# EAGLE design sentinel psionic driver (EAGLE 7.6.0)
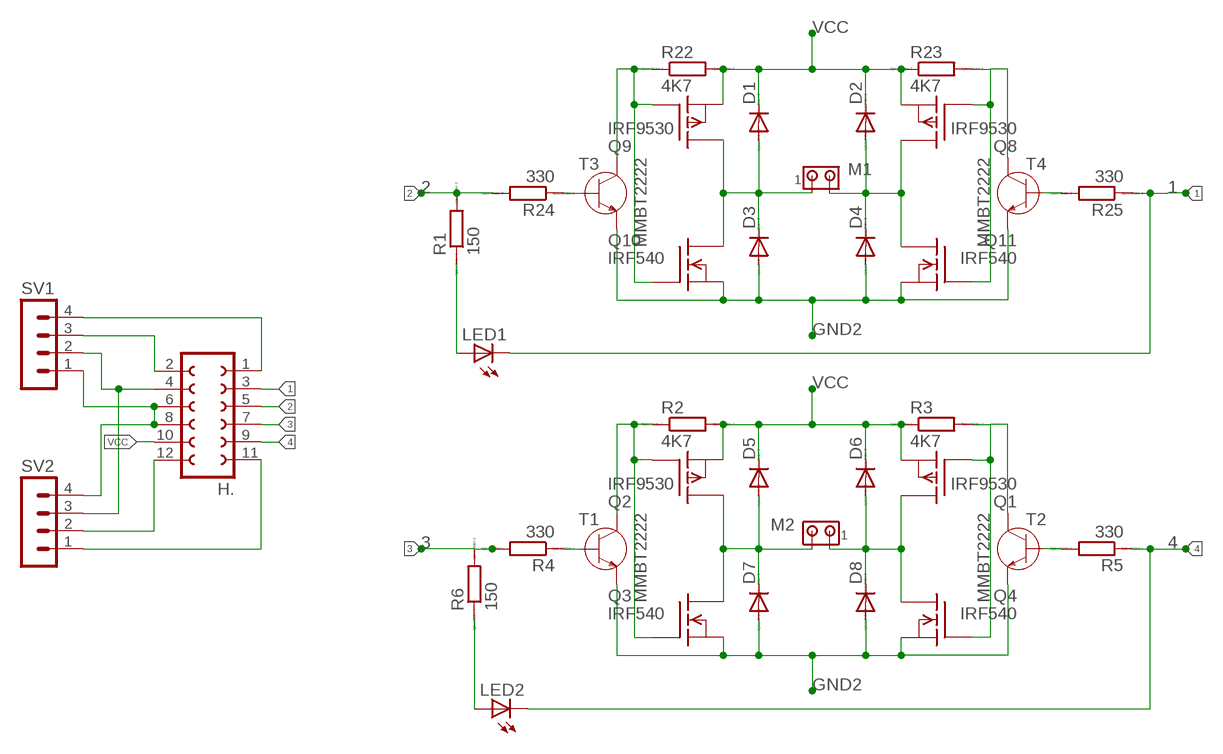
[diagram p0: schematic, sheet 1]

## Parts
D1  DIODE-DO-214AC  [DO-214AC]
D2  DIODE-DO-214AC  [DO-214AC]
D3  DIODE-DO-214AC  [DO-214AC]
D4  DIODE-DO-214AC  [DO-214AC]
D5  DIODE-DO-214AC  [DO-214AC]
D6  DIODE-DO-214AC  [DO-214AC]
D7  DIODE-DO-214AC  [DO-214AC]
D8  DIODE-DO-214AC  [DO-214AC]
H.  FE06-2  [FE06-2]
LED1  LED3MM  [LED3MM]
LED2  LED3MM  [LED3MM]
M1  MTA02-100  [10X02MTA]
M2  MTA02-100  [10X02MTA]
Q1  IRF9530  [TO220]
Q2  IRF9530  [TO220]
Q3  IRF540  [TO220]
Q4  IRF540  [TO220]
Q8  IRF9530  [TO220]
Q9  IRF9530  [TO220]
Q10  IRF540  [TO220]
Q11  IRF540  [TO220]
R1  150  RR1206  [R1206]
R2  4K7  RR1206  [R1206]
R3  4K7  RR1206  [R1206]
R4  330  RR1206  [R1206]
R5  330  RR1206  [R1206]
R6  150  RR1206  [R1206]
R22  4K7  RR1206  [R1206]
R23  4K7  RR1206  [R1206]
R24  330  RR1206  [R1206]
R25  330  RR1206  [R1206]
SV1  MA04-1  [MA04-1]
SV2  MA04-1  [MA04-1]
T1  MMBT2222  [SOT23]
T2  MMBT2222  [SOT23]
T3  MMBT2222  [SOT23]
T4  MMBT2222  [SOT23]

## Nets
1: H..3 LED1.K(C) R25.1
2: H..5 R1.2 R24.2
3: H..7 R4.2 R6.2
4: H..9 LED2.K(C) R5.1
GND2: D3.A D4.A D7.A D8.A H..6 H..8 Q3.3(S) Q4.3(S) Q10.3(S) Q11.3(S) SV1.1 SV2.4 T1.2(E) T2.2(E) T3.2(E) T4.2(E)
N$3: R25.2 T4.1(B)
N$4: LED1.A R1.1
N$5: R5.2 T2.1(B)
N$6: Q2.1(G) Q3.1(G) R2.1 T1.3(C)
N$7: D5.A D7.C M2.2 Q2.2(D) Q3.2(D)
N$8: D6.A D8.C M2.1 Q1.2(D) Q4.2(D)
N$9: Q1.1(G) Q4.1(G) R3.2 T2.3(C)
N$10: Q9.1(G) Q10.1(G) R22.1 T3.3(C)
N$11: R4.1 T1.1(B)
N$12: LED2.A R6.1
N$15: H..4 SV1.2 SV2.3
N$16: H..2 SV1.3
N$17: H..1 SV1.4
N$18: H..12 SV2.2
N$19: H..11 SV2.1
N$32: D1.A D3.C M1.1 Q9.2(D) Q10.2(D)
N$33: D2.A D4.C M1.2 Q8.2(D) Q11.2(D)
N$35: Q8.1(G) Q11.1(G) R23.2 T4.3(C)
N$42: R24.1 T3.1(B)
VCC: D1.C D2.C D5.C D6.C H..10 Q1.3(S) Q2.3(S) Q8.3(S) Q9.3(S) R2.2 R3.1 R22.2 R23.1

## Library data of the parts
D1-D8 = diode:DIODE-: DIODE
H. = con-lsta:FE06-2: FEMALE HEADER; OC_FARNELL: unknown; OC_NEWARK: unknown
LED1 LED2 = led:LED: LED OSRAM: - CHIPLED LG R971, LG N971, LY N971, LG Q971, LY Q971, LO R971, LY R971 LH N974, LH R974 LS Q976, LO Q976, LY Q976 LO Q996 - Hyper CHIPLED LW Q18S LB Q993, LB Q99A, LB R99A - SideLED LS A670, LO A670, LY A670, LG A670, LP A670 LB A673, LV A673, LT A673, LW A673 LH A674 LY A675 LS A676, LA A676, LO A676, LY A676, LW A676 LS A679, LY A679, LG A679 - Hyper Micro SIDELED® LS Y876, LA Y876, LO Y876, LY Y876 LT Y87S - SmartLED LW L88C, LW L88S LB L89C, LB L89S, LG L890 LS L89K, LO L89K, LY L89K LS L896, LA L896, LO L896, LY L896 - TOPLED LS T670, LO T670, LY T670, LG T670, LP T670 LSG T670, LSP T670, LSY T670, LOP T670, LYG T670 LG T671, LOG T671, LSG T671 LB T673, LV T673, LT T673, LW T673 LH T674 LS T676, LA T676, LO T676, LY T676, LB T676, LH T676, LSB T676, LW T676 LB T67C, LV T67C, LT T67C, LS T67K, LO T67K, LY T67K, LW E67C LS E67B, LA E67B, LO E67B, LY E67B, LB E67C, LV E67C, LT E67C LW T67C LS T679, LY T679, LG T679 LS T770, LO T770, LY T770, LG T770, LP T770 LB T773, LV T773, LT T773, LW T773 LH T774 LS E675, LA E675, LY E675, LS T675 LS T776, LA T776, LO T776, LY T776, LB T776 LHGB T686 LT T68C, LB T68C - Hyper Mini TOPLED® LB M676 - Mini TOPLED Santana® LG M470 LS M47K, LO M47K, LY M47K Source: http://www.osram.convergy.de LUXEON: - LUMILED® LXK2-PW12-R00, LXK2-PW12-S00, LXK2-PW14-U00, LXK2-PW14-V00 LXK2-PM12-R00, LXK2-PM12-S00, LXK2-PM14-U00 LXK2-PE12-Q00, LXK2-PE12-R00, LXK2-PE12-S00, LXK2-PE14-T00, LXK2-PE14-U00 LXK2-PB12-K00, LXK2-PB12-L00, LXK2-PB12-M00, LXK2-PB14-N00, LXK2-PB14-P00, LXK2-PB14-Q00 LXK2-PR12-L00, LXK2-PR12-M00, LXK2-PR14-Q00, LXK2-PR14-R00 LXK2-PD12-Q00, LXK2-PD12-R00, LXK2-PD12-S00 LXK2-PH12-R00, LXK2-PH12-S00 LXK2-PL12-P00, LXK2-PL12-Q00, LXK2-PL12-R00 Source: www.luxeon.com KINGBRIGHT: KA-3528ASYC Source: www.kingbright.com
M1 M2 = con-amp:MTA02-100: AMP connector
Q1 Q2 Q8 Q9 = transistor-fet:IRF9530: P-Channel Enhancement MOSFET (HEXFET); -100V; -12A; 0,3Ohm
Q3 Q4 Q10 Q11 = transistor-fet:IRF540: N-Channel Enhancement MOSFET (HEXFET); 100V; 28A; 0,077Ohm
R1-R6 R22-R25 = eagle-ltspice:R: RESISTOR, European symbol; SPICEMODEL: NONE; SPICEPREFIX: R
SV1 SV2 = con-lstb:MA04-1: PIN HEADER; OC_FARNELL: unknown; OC_NEWARK: unknown
T1-T4 = semiconductor:MMBT2222: General Purpose Transistors, NPN Silicon Rating MMBT2222LT1G MMBT2222ALT1G Collector-Emitter Voltage (VCEO) 30 Vdc 40 Vdc Collector-Base Voltage (VCBO) 60 Vdc 75 Vdc Emitter-Base Voltage (VEBO) 5.0 Vdc 6.0 Vdc Collector Current Continuous (IC) 600 mAdc 1100 mAdc Collector Current Peak (ICM) 600 mAdc 1100 mAdc

## Board
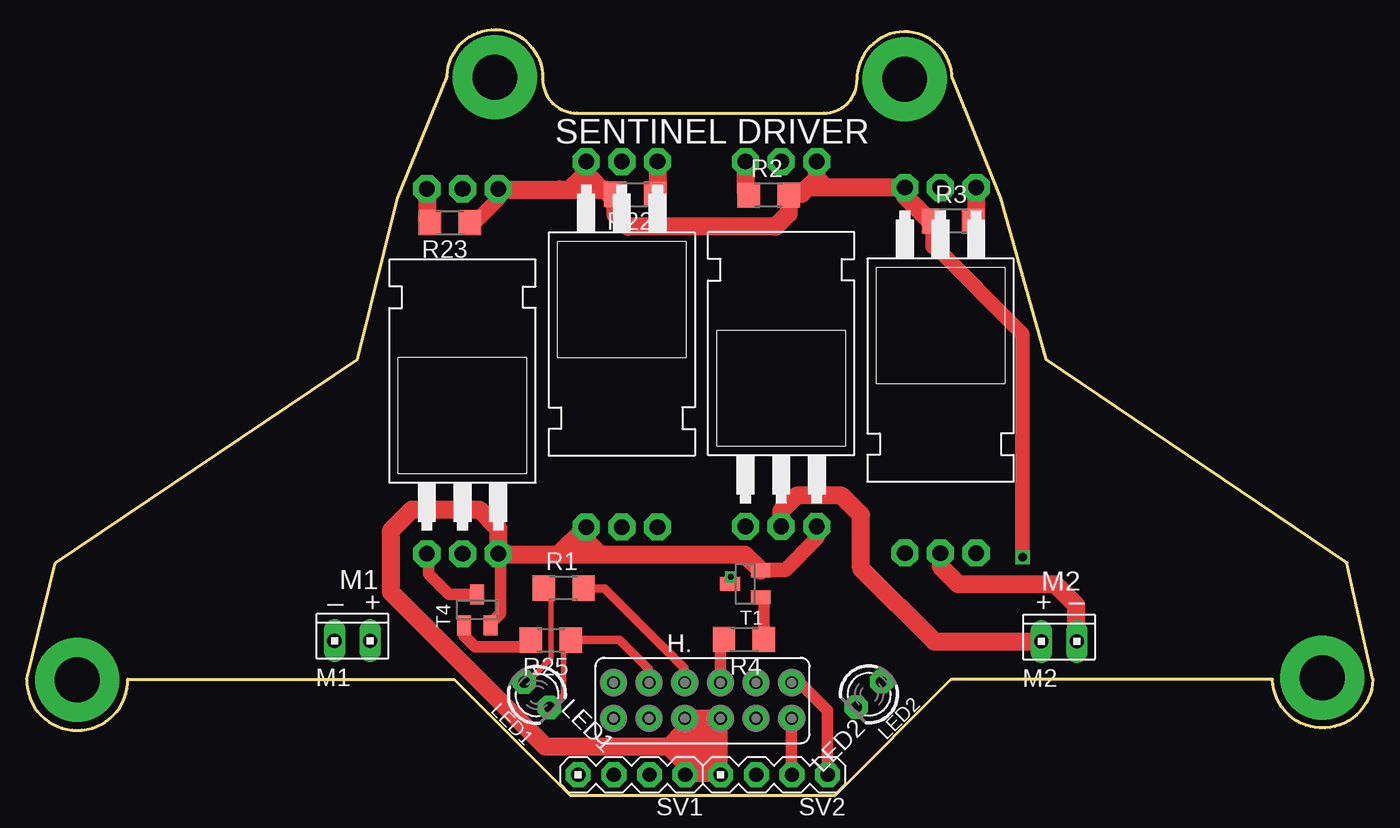
[diagram p1: board, top side]
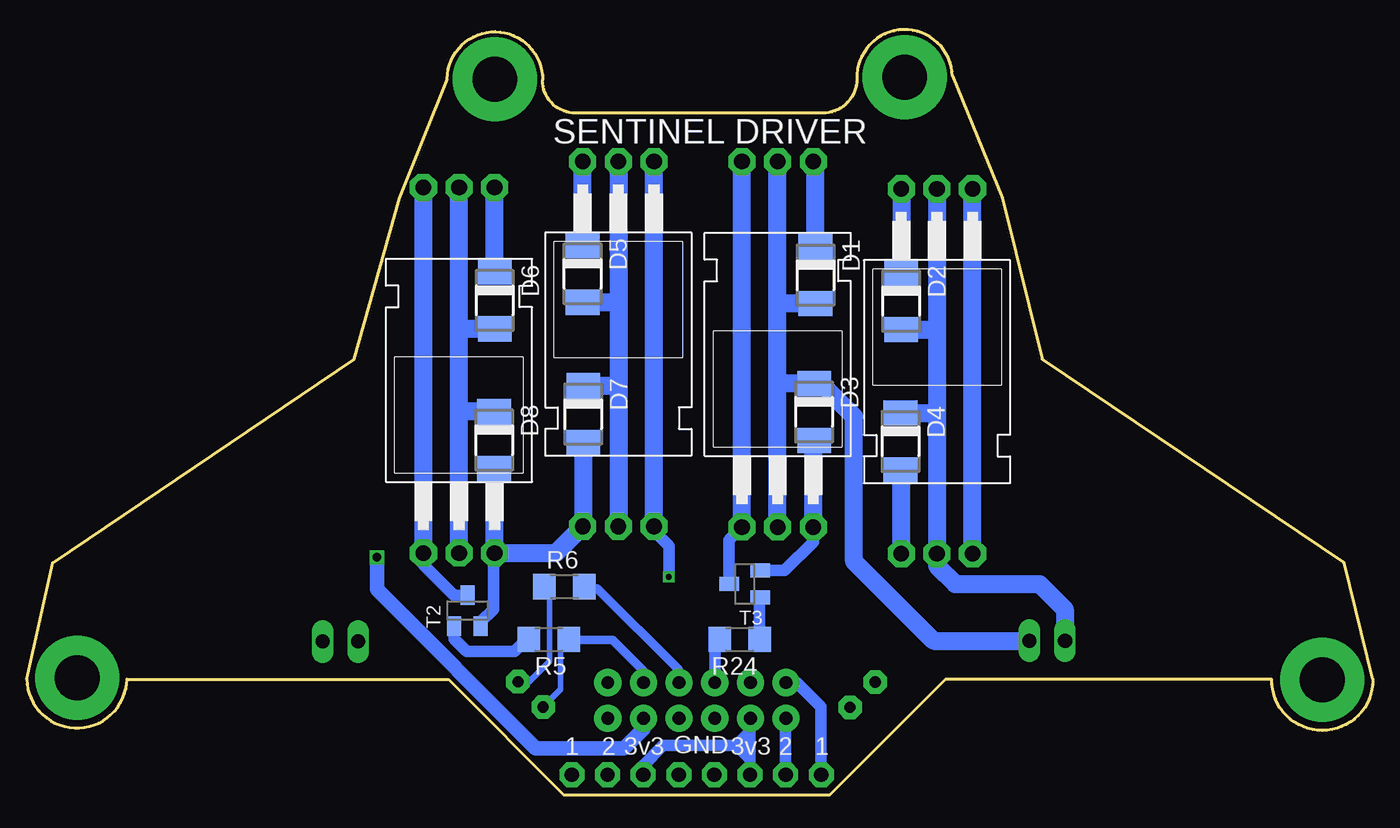
[diagram p2: board, bottom side, seen from below]

No outline drawn. Coordinates in mm, seen from the top.
Copper layers (1*16): Top 0.035mm / dielectric 1.5mm / Bottom 0.035mm
Design rules "default": minimum track width 10mil, minimum drill 24mil, track to track 8mil, track to pad 8mil, pad to pad 8mil, via to via 8mil, smd to smd 8mil, copper to edge 40mil, drill to drill 8mil, minimum pad ring 10mil, minimum via ring 8mil, stop-mask expansion 4mil, vias tented up to drill 0mil, thermal gap 10mil
Milling: 20 lines

### Footprints (pad centres in the part's own frame; a part is rotated, then mirrored left to right if it is on the bottom)
DO-214AC = smd 1.8 x 2.4: A 2.025,0; C -2.025,0
FE06-2 = drill 0.914 pad 1.93: 1 -6.35,1.27; 2 -6.35,-1.27; 3 -3.81,1.27; 4 -3.81,-1.27; 5 -1.27,1.27; 6 -1.27,-1.27; 7 1.27,1.27; 8 1.27,-1.27; 9 3.81,1.27; 10 3.81,-1.27; 11 6.35,1.27; 12 6.35,-1.27
LED3MM = drill 0.8 pad 1.676 octagon: A -1.27,0; K 1.27,0
10X02MTA = drill 1.016 long: 1 1.27,0; 2 -1.27,0
TO220 = drill 1.118 pad 1.93 octagon: 1 -2.54,-6.35; 2 0,-6.35; 3 2.54,-6.35
R1206 = smd 1.6 x 1.803: 1 -1.422,0; 2 1.422,0
MA04-1 = drill 1.016 pad 1.778 octagon: 1 -3.81,0; 2 -1.27,0; 3 1.27,0; 4 3.81,0
SOT23 = smd 1 x 1.4: 1 -0.95,-1.1; 2 0.95,-1.1; 3 0,1.1

### Placement (x,y rotation side)
D1  -8.35,26.5 270 bottom
D2  -14.45,24.65 270 bottom
D3  -8.25,16.75 270 bottom
D4  -14.4,14.65 270 bottom
D5  8.25,26.6 270 bottom
D6  14.5,24.7 270 bottom
D7  8.2,16.6 270 bottom
D8  14.55,14.75 270 bottom
H  [FE06-2]  0.1,-3.8 0 top
H.  0.1,-3.8 0 top
LED1  -11.7,-3.4 315 top
LED2  11.95,-3.37 225 top
M1  -24.85,0.45 0 top
M2  25.5,0.4 0 top
Q1  17.05,26.4 180 top
Q2  5.7,28.25 180 bottom
Q3  5.7,14.95 0 top
Q4  17.05,13.05 0 bottom
Q8  -17,26.3 180 bottom
Q9  -5.65,28.25 180 top
Q10  -5.65,14.9 0 bottom
Q11  -17,13 0 top
R1  -9.8,4.2 0 top
R2  4.8,32.2 0 top
R3  17.95,30.35 0 top
R4  3.05,0.55 180 top
R5  10.65,0.55 180 bottom
R6  9.55,4.3 0 bottom
R22  -4.7,32.25 180 top
R23  -17.9,30.25 180 top
R24  -2.95,0.55 180 bottom
R25  -10.7,0.5 180 top
SV1  -4.95,-9.1 180 top
SV2  5.2,-9.1 180 top
T1  3.15,4.5 90 top
T2  16.45,2.6 0 bottom
T3  -3.3,4.5 90 bottom
T4  -15.95,2.65 0 top

### Tracks (layer width: path | path; a pad name or v marks a point on that pad's centre or on a via)
1
  Top 0.406: R25.1 -9.6,0.5 -9.8,0.3 -9.8,-3.39 -10.71,-4.3 LED1.K
  Top 0.61: R25.1 -5.8,0.5 -3.7,-1.6 H..3
2
  Top 0.61: H..5 -1.17,-1.53 -6.9,4.2 R1.2
  Bottom 0.813: H..5 -1.17,0.19 R24.2
3
  Top 0.813: H..7 1.37,0.29 R4.2
  Bottom 0.61: H..7 1.37,-1.63 7.2,4.2 8.03,4.2 R6.2
4
  Bottom 0.406: 9.18,0.5 R5.1 9.25,0.55 9.8,0 9.8,-3.01 LED2.K
  Bottom 0.61: 9.18,0.5 6.1,0.5 3.9,-1.7 H..9
GND2
  Top 0.813: Q11.3 -14.4,6.59 -14.3,6.49 -14.3,2.4 -15,1.7 T4.2 | 8.2,8.56 Q3.3
  Top 1.016: Q3.3 8.3,8.54 8.3,7.8 6,5.5 4.3,5.5 T1.2 | SV1.1 SV2.4
  Top 1.27: -14.4,6.59 -10.15,6.59 Q10.3 | Q10.3 | Q11.3 -14.46,8.46 -15.8,9.8 -20.6,9.8 -22.1,8.3 -22.1,3.9 -11.1,-7.1 -2.3,-7.1 | Q10.3 -8.2,7.6 -7.2,6.6 | -7.2,6.6 -6.9,6.6 3.1,6.6 T1.2 | -2.3,-7.1 -1.14,-8.26 SV1.1 | -2.3,-7.1 -1.17,-5.97 H..6 H..8 | -10.3,6.6 -7.2,6.6
  Bottom 0.813: T2.2 15.5,1.8 14.6,2.7 14.6,6.61 Q4.3 | T3.2 -6.15,5.45 -8.2,7.5 Q10.3
  Bottom 1.27: Q11.3 -14.46,12.56 D4.A | Q10.3 -8.19,14.66 D3.A | D7.A 8.2,8.64 Q3.3 10.14,6.7 Q4.3 14.51,12.69 D8.A
N$1  (via drill 3.2 pad 6)
  other vias: -44.45,-2.34
N$2  (via drill 3.2 pad 6)
  other vias: 44.25,-2.19
N$3
  Top 0.813: T4.1 -16.9,0.8 -16.1,0 -12.6,0 -12.12,0.48 R25.2
N$4
  Top 0.406: R1.1 -10.7,3.68 -10.7,-0.8 -12.4,-2.5 LED1.A
N$5
  Bottom 0.813: R5.2 12.25,0.55 13.1,-0.3 16.5,-0.3 17.4,0.6 T2.1
N$6  (via drill 0.4)
  Top 0.813: 3.16,32.42 R2.1 | v2.1,5 2.1,4.55 T1.3
  Top 1.016: R2.1 3.36,32.2 3.16,32.4
  Top 1.27: Q2.1 3.16,32.42
  Bottom 0.813: Q3.1 3.16,8.26 2.1,7.2 v2.1,5
  Bottom 1.27: Q3.1 Q2.1
N$7
  Top 1.27: Q3.2 5.7,9.7 6.8,10.8 10,10.8 11.4,9.4 11.4,5.6 16.6,0.4 M2.2
  Bottom 1.27: Q2.2 5.7,24.5 | 5.7,24.5 5.7,18.7 | 5.7,18.7 Q3.2 | D5.A 5.78,24.57 5.7,24.5 | D7.C 5.78,18.62 5.7,18.7
N$8
  Top 1.27: Q4.2 17.05,5.75 18.3,4.5 25.2,4.5 26.7,3 26.7,0.47 M2.1
  Bottom 1.27: Q4.2 17.05,16.7 | 17.05,16.7 17.05,22.7 | 17.05,22.7 Q1.2 | D6.A 17.02,22.68 17.05,22.7 | D8.C 16.98,16.77 17.05,16.7
N$9
  Top 0.813: 19.59,30.57 R3.2
  Top 1.27: Q1.1 19.59,30.57
  Bottom 0.813: T2.3 17.4,3.7 19.6,5.9 Q4.1
  Bottom 1.27: Q4.1 Q1.1
N$10
  Top 0.813: -3.11,32.42 R22.1
  Top 1.016: R22.1 -3.28,32.33 -3.11,32.5
  Top 1.27: Q9.1 -3.11,32.42
  Bottom 0.813: T3.3 -2.2,7.64 Q10.1
  Bottom 1.27: Q10.1 Q9.1
N$11
  Top 0.813: R4.1 4.47,3.33 T1.1
N$12
  Bottom 0.406: R6.1 10.6,3.93 10.6,-1 12.17,-2.57 12.85,-2.57 LED2.A
N$13
  Top 1.27: -10.1,32.6 -6.9,32.6 -6.25,31.95
N$14  (via drill 3.2 pad 6)
  other vias: -14.7,40.61
N$15
  Bottom 0.813: -3.68,-7 -2.7,-7 | -2.7,-7 2.5,-7 3.95,-8.45 3.95,-9.08 SV2.3 | SV1.2 -3.68,-7 | -3.68,-7 -3.68,-5.1 H..4 | -3.6,-7.9 -2.7,-7 | -2.7,-7 -3.6,-6.1
N$16
  Bottom 0.813: SV1.3 -6.22,-5.1 H..2
N$17
  Bottom 0.813: SV1.4 -8.75,-4.25 -7,-2.5 -6.28,-2.5 H..1
N$18
  Top 0.813: H..12 6.45,-9.08 SV2.2
N$19
  Top 0.813: SV2.1 9,-4.5 7,-2.5 6.48,-2.5 H..11
N$20  (via drill 3.2 pad 6)
  other vias: 14.5,40.46
N$21
  Top 0.813: -1,-5 -1,-9
N$22
  Top 0.813: -0.5,-5 -0.5,-9
N$23
  Top 0.813: 1.5,-5.5 1.5,-9
N$24
  Top 0.813: 1,-9 1,-5
N$25
  Top 0.813: 0.5,-5.5 0.5,-9
N$26
  Top 0.813: 0,-9 0,-5.5
N$32
  Bottom 1.016: -8.75,18.77 D3.C
  Bottom 1.27: Q10.2 -5.65,18.7 | -5.65,18.7 -5.65,24.3 | -5.65,24.3 Q9.2 | D1.A -5.83,24.48 -5.65,24.3 | D3.C -5.72,18.77 -5.65,18.7 | -8.75,18.77 -11.1,16.43 -11.1,6.1 -16.75,0.45 M1.1
N$33
  Bottom 1.016: -13.65,16.73 D4.C
  Bottom 1.27: Q8.2 -17,22.8 | -17,22.8 -17,16.6 | -17,16.6 Q11.2 -17,5.8 -18.3,4.5 -24.3,4.5 -26.1,2.7 -26.1,0.47 M1.2 | D2.A -16.82,22.62 -17,22.8 | D4.C -16.93,16.68 -17,16.6
N$35
  Top 0.813: -19.54,30.47 R23.2 | T4.3 -17.95,3.75 -19.4,5.2 -19.4,6.51 Q11.1
  Top 1.27: Q8.1 -19.54,30.47
  Bottom 0.813: -19.4,6.51 Q11.1
  Bottom 1.27: Q11.1 Q8.1
N$42
  Bottom 0.813: R24.1 -4.37,3.52 T3.1
N$79  (via drill 3.05 pad 6)
  other vias: -44.45,-2.34
N$80  (via drill 3.05 pad 6)
  other vias: 44.25,-2.19
VCC  (via drill 0.6)
  Top 1.016: -14.5,32.61 Q8.3 -14.4,32.59 -14.4,32 -16.15,30.25 R23.1 | R22.2 -6.55,32.25 -8.2,33.9 Q9.3 | 8.2,34.56 Q2.3 | v22.9,6.4 22.9,22.3 16.6,28.6 16.6,30.28 R3.1
  Top 1.27: R22.2 -6.1,32.23 -6.1,30.85 -5.2,29.95 5.3,29.95 6.22,30.87 R2.2 6.32,32.3 7.15,32.3 8.2,33.35 8.2,34.56 | -14.4,32.59 -9.36,32.59 -8.35,33.6 -8.35,34.44 Q9.3 | 8.9,32.75 9.5,32.75 Q1.3 14.5,32.15 16.6,30.05 16.6,28.6 | 8.9,32.75 8.25,33.4 Q2.3 | 8.9,32.75 7.8,32.75
  Bottom 1.016: H..10 3.91,-5.81 5.3,-7.2 11.6,-7.2 22.9,4.1 v22.9,6.4
  Bottom 1.27: Q8.3 -14.46,26.68 D2.C | D1.C -8.35,34.44 Q9.3 | D5.C Q2.3 | D6.C Q1.3

### Text on the board
tPlace: SENTINEL DRIVER | M1 | M2 | _ | _ | + | + | LED1 | LED2
bPlace: SENTINEL DRIVER | 1 | 2 | 3v3 | GND | 3v3 | 2 | 1